# EAGLE design CH348L (EAGLE 9.6.2)
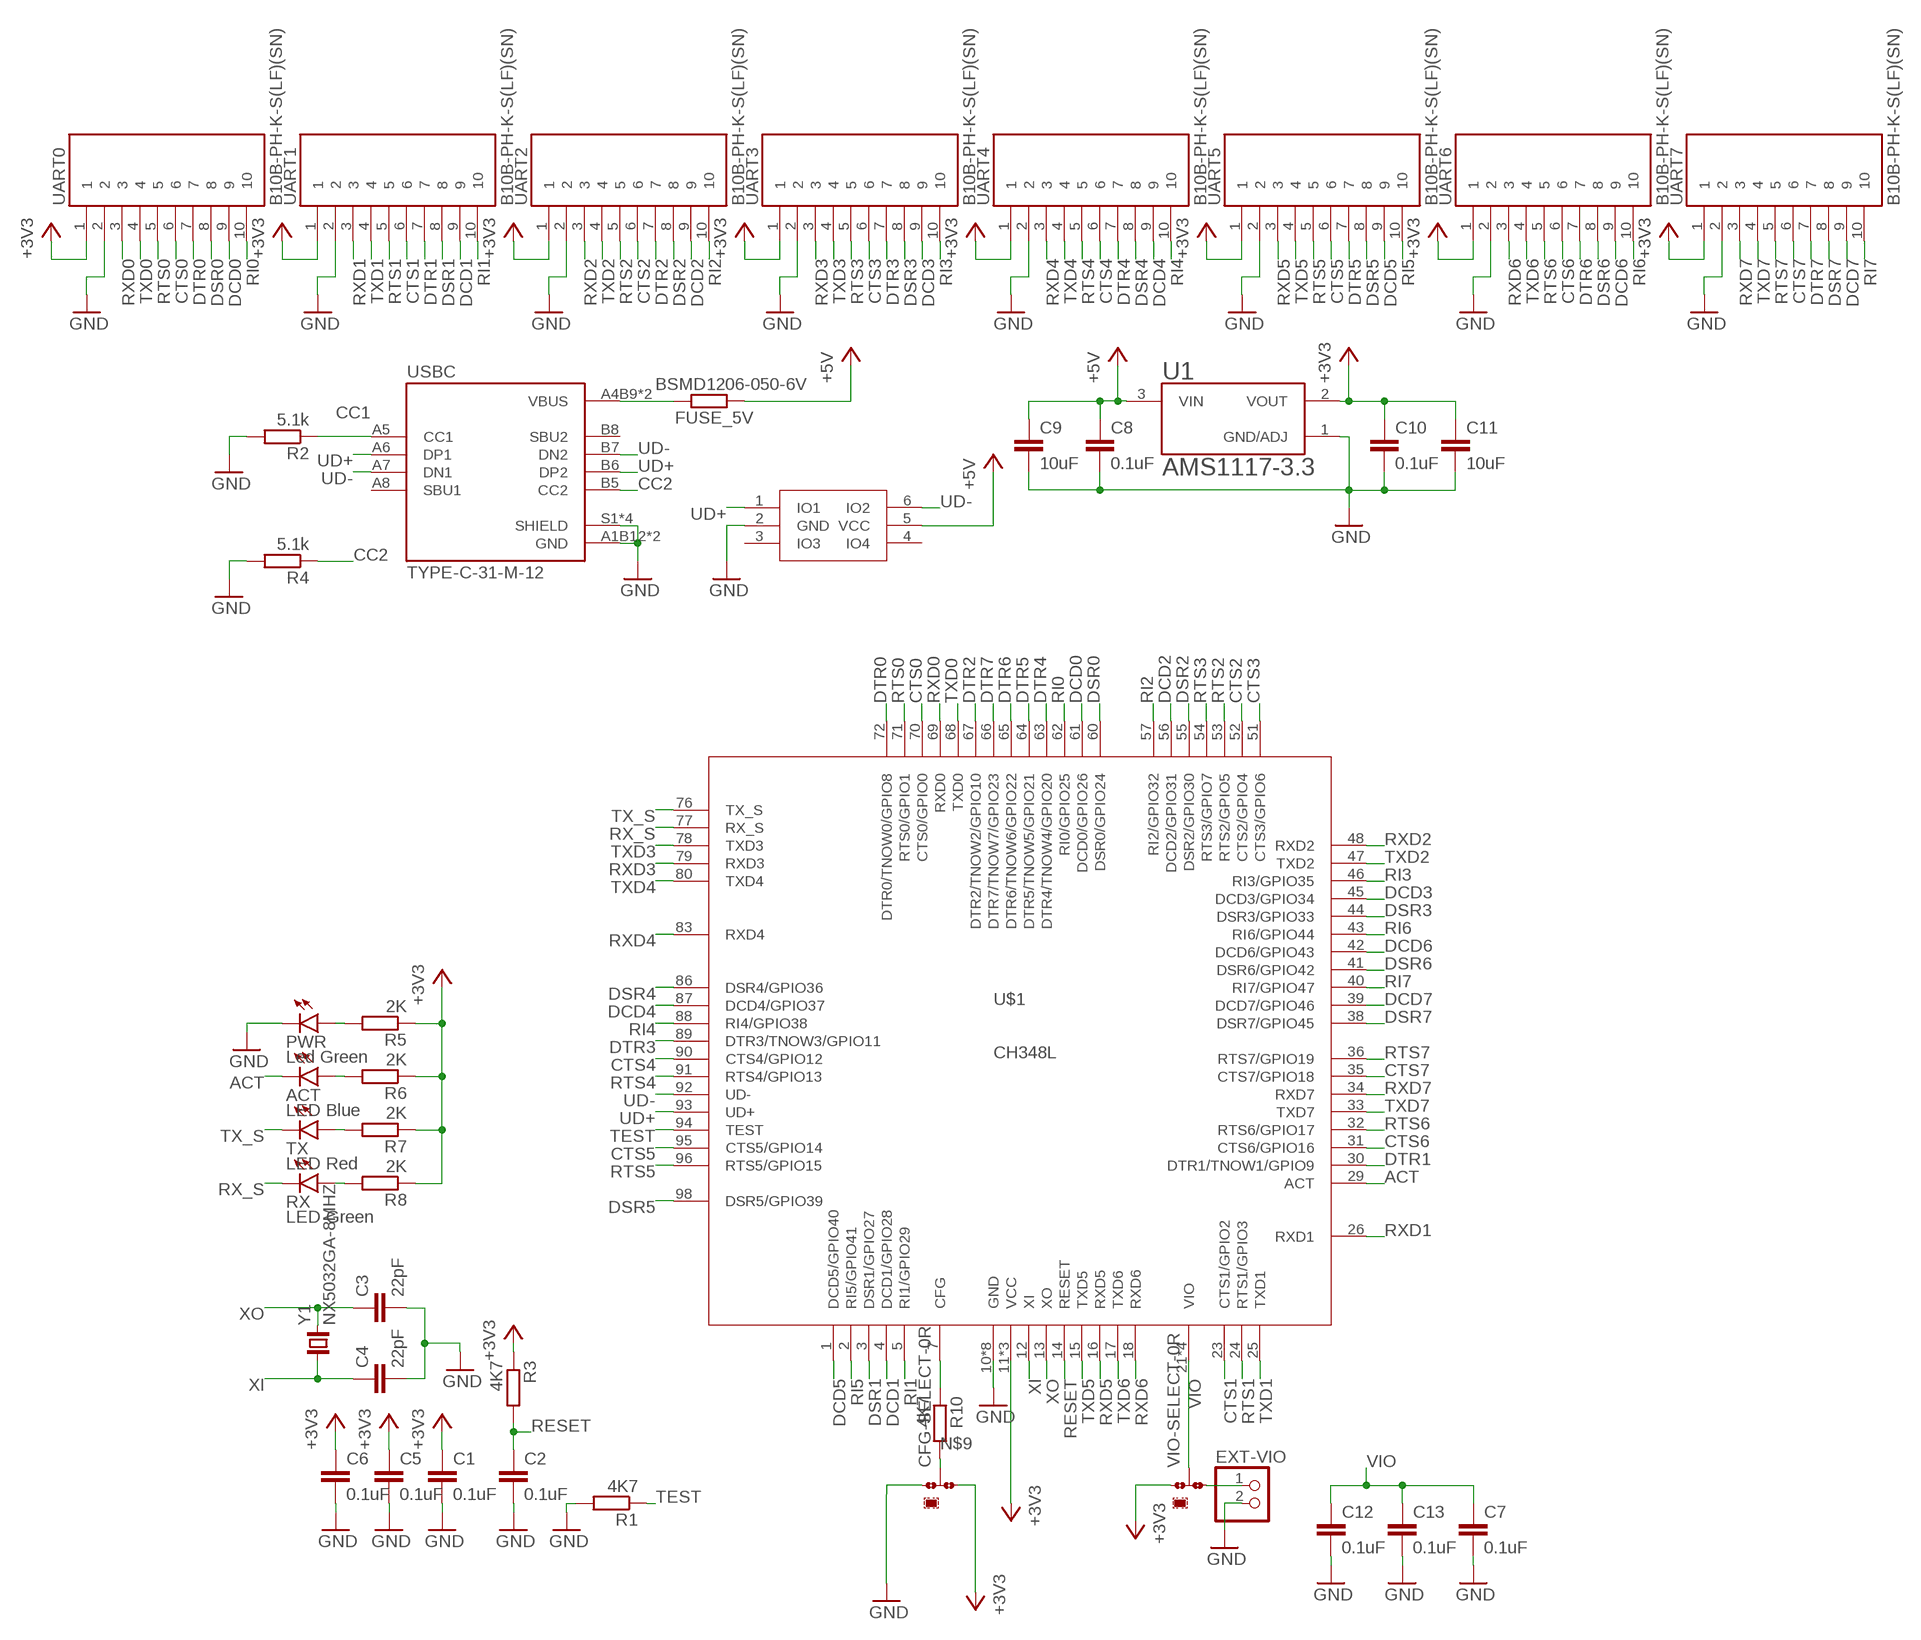
[diagram p0: schematic, sheet 1]

## Parts
ACT  LED Blue  LEDCHIP-LED0603  [CHIP-LED0603]
C1  0.1uF  C-EUC0603  [C0603]
C2  0.1uF  C-EUC0603  [C0603]
C3  22pF  C-EUC0603  [C0603]
C4  22pF  C-EUC0603  [C0603]
C5  0.1uF  C-EUC0603  [C0603]
C6  0.1uF  C-EUC0603  [C0603]
C7  0.1uF  C-EUC0603  [C0603]
C8  0.1uF  C-EUC0603  [C0603]
C9  10uF  C-EUC0805  [C0805]
C10  0.1uF  C-EUC0603  [C0603]
C11  10uF  C-EUC0805  [C0805]
C12  0.1uF  C-EUC0603  [C0603]
C13  0.1uF  C-EUC0603  [C0603]
CFG-SELECT  0R-JUMPA  [A0R-JMP]
EXT-VIO  PINHD-1X2  [1X02]
FUSE_5V  BSMD1206-050-6V  R-EU_R1206  [R1206]
PWR  Led Green  LEDCHIP-LED0603  [CHIP-LED0603]
R1  4K7  R-EU_R0603  [R0603]
R2  5.1k  R-EU_R0603  [R0603]
R3  4K7  R-EU_R0603  [R0603]
R4  5.1k  R-EU_R0603  [R0603]
R5  2K  R-EU_R0603  [R0603]
R6  2K  R-EU_R0603  [R0603]
R7  2K  R-EU_R0603  [R0603]
R8  2K  R-EU_R0603  [R0603]
R10  4K7  R-EU_R0603  [R0603]
RX  LED Green  LEDCHIP-LED0603  [CHIP-LED0603]
TX  LED Red  LEDCHIP-LED0603  [CHIP-LED0603]
U1  AMS1117-3.3  [SOT229P700X180-4N]
U5  ESDU5V0H4  [SOT-23-6]
U$1  CH348L  [LQFP100_14X14]
UART0  B10B-PH-K-S(LF)(SN)  S10B-PH-K-S(LF)(SN)  [JST_S10B-PH-K-S(LF)(SN)]
UART1  B10B-PH-K-S(LF)(SN)  S10B-PH-K-S(LF)(SN)  [JST_S10B-PH-K-S(LF)(SN)]
UART2  B10B-PH-K-S(LF)(SN)  S10B-PH-K-S(LF)(SN)  [JST_S10B-PH-K-S(LF)(SN)]
UART3  B10B-PH-K-S(LF)(SN)  S10B-PH-K-S(LF)(SN)  [JST_S10B-PH-K-S(LF)(SN)]
UART4  B10B-PH-K-S(LF)(SN)  S10B-PH-K-S(LF)(SN)  [JST_S10B-PH-K-S(LF)(SN)]
UART5  B10B-PH-K-S(LF)(SN)  S10B-PH-K-S(LF)(SN)  [JST_S10B-PH-K-S(LF)(SN)]
UART6  B10B-PH-K-S(LF)(SN)  S10B-PH-K-S(LF)(SN)  [JST_S10B-PH-K-S(LF)(SN)]
UART7  B10B-PH-K-S(LF)(SN)  S10B-PH-K-S(LF)(SN)  [JST_S10B-PH-K-S(LF)(SN)]
USBC  TYPE-C-31-M-12  [HRO_TYPE-C-31-M-12]
VIO-SELECT  0R-JUMPA  [A0R-JMP]
Y1  NX5032GA-8MHZ  NX5032GA  [2-SMD-5X3]

## Nets
+3V3: C1.1 C5.1 C6.1 C10.1 C11.1 CFG-SELECT.3 R3.1 R5.1 R6.1 R7.1 R8.1 U1.2(VOUT) U$1.11(VCC) U$1.28(VCC) U$1.75(VCC) UART0.1 UART1.1 UART2.1 UART3.1 UART4.1 UART5.1 UART6.1 UART7.1 VIO-SELECT.1
+5V: C8.1 C9.1 FUSE_5V.1 U1.3(VIN) U5.5(VCC)
ACT: ACT.C U$1.29(ACT)
CC1: R2.1 USBC.A5(CC1)
CC2: R4.1 USBC.B5(CC2)
CFG: R10.1 U$1.7(CFG)
CTS0: U$1.70(CTS0/GPIO0) UART0.6
CTS1: U$1.23(CTS1/GPIO2) UART1.6
CTS2: U$1.52(CTS2/GPIO4) UART2.6
CTS3: U$1.51(CTS3/GPIO6) UART3.6
CTS4: U$1.90(CTS4/GPIO12) UART4.6
CTS5: U$1.95(CTS5/GPIO14) UART5.6
CTS6: U$1.31(CTS6/GPIO16) UART6.6
CTS7: U$1.35(CTS7/GPIO18) UART7.6
DCD0: U$1.61(DCD0/GPIO26) UART0.9
DCD1: U$1.4(DCD1/GPIO28) UART1.9
DCD2: U$1.56(DCD2/GPIO31) UART2.9
DCD3: U$1.45(DCD3/GPIO34) UART3.9
DCD4: U$1.87(DCD4/GPIO37) UART4.9
DCD5: U$1.1(DCD5/GPIO40) UART5.9
DCD6: U$1.42(DCD6/GPIO43) UART6.9
DCD7: U$1.39(DCD7/GPIO46) UART7.9
DSR0: U$1.60(DSR0/GPIO24) UART0.8
DSR1: U$1.3(DSR1/GPIO27) UART1.8
DSR2: U$1.55(DSR2/GPIO30) UART2.8
DSR3: U$1.44(DSR3/GPIO33) UART3.8
DSR4: U$1.86(DSR4/GPIO36) UART4.8
DSR5: U$1.98(DSR5/GPIO39) UART5.8
DSR6: U$1.41(DSR6/GPIO42) UART6.8
DSR7: U$1.38(DSR7/GPIO45) UART7.8
DTR0: U$1.72(DTR0/TNOW0/GPIO8) UART0.7
DTR1: U$1.30(DTR1/TNOW1/GPIO9) UART1.7
DTR2: U$1.67(DTR2/TNOW2/GPIO10) UART2.7
DTR3: U$1.89(DTR3/TNOW3/GPIO11) UART3.7
DTR4: U$1.63(DTR4/TNOW4/GPIO20) UART4.7
DTR5: U$1.64(DTR5/TNOW5/GPIO21) UART5.7
DTR6: U$1.65(DTR6/TNOW6/GPIO22) UART6.7
DTR7: U$1.66(DTR7/TNOW7/GPIO23) UART7.7
GND: C1.2 C2.2 C3.2 C4.2 C5.2 C6.2 C7.2 C8.2 C9.2 C10.2 C11.2 C12.2 C13.2 CFG-SELECT.1 EXT-VIO.2 PWR.C R1.2 R2.2 R4.2 U1.1(GND/ADJ) U5.2(GND) U$1.10(GND) U$1.19(GND) U$1.20(GND) U$1.27(GND) U$1.37(GND) U$1.49(GND) U$1.74(GND) U$1.99(GND) UART0.2 UART1.2 UART2.2 UART3.2 UART4.2 UART5.2 UART6.2 UART7.2 USBC.A1B12(GND) USBC.B1A12(GND) USBC.S1(SHIELD) USBC.S2(SHIELD) USBC.S3(SHIELD) USBC.S4(SHIELD)
N$1: PWR.A R5.2
N$2: FUSE_5V.2 USBC.A4B9(VBUS) USBC.B4A9(VBUS)
N$3: ACT.A R6.2
N$4: R7.2 TX.A
N$5: R8.2 RX.A
N$8: EXT-VIO.1 VIO-SELECT.3
N$9: CFG-SELECT.2 R10.2
RESET: C2.1 R3.2 U$1.14(RESET)
RI0: U$1.62(RI0/GPIO25) UART0.10
RI1: U$1.5(RI1/GPIO29) UART1.10
RI2: U$1.57(RI2/GPIO32) UART2.10
RI3: U$1.46(RI3/GPIO35) UART3.10
RI4: U$1.88(RI4/GPIO38) UART4.10
RI5: U$1.2(RI5/GPIO41) UART5.10
RI6: U$1.43(RI6/GPIO44) UART6.10
RI7: U$1.40(RI7/GPIO47) UART7.10
RTS0: U$1.71(RTS0/GPIO1) UART0.5
RTS1: U$1.24(RTS1/GPIO3) UART1.5
RTS2: U$1.53(RTS2/GPIO5) UART2.5
RTS3: U$1.54(RTS3/GPIO7) UART3.5
RTS4: U$1.91(RTS4/GPIO13) UART4.5
RTS5: U$1.96(RTS5/GPIO15) UART5.5
RTS6: U$1.32(RTS6/GPIO17) UART6.5
RTS7: U$1.36(RTS7/GPIO19) UART7.5
RX_S: RX.C U$1.77(RX_S)
RXD0: U$1.69(RXD0) UART0.3
RXD1: U$1.26(RXD1) UART1.3
RXD2: U$1.48(RXD2) UART2.3
RXD3: U$1.79(RXD3) UART3.3
RXD4: U$1.83(RXD4) UART4.3
RXD5: U$1.16(RXD5) UART5.3
RXD6: U$1.18(RXD6) UART6.3
RXD7: U$1.34(RXD7) UART7.3
TEST: R1.1 U$1.94(TEST)
TX_S: TX.C U$1.76(TX_S)
TXD0: U$1.68(TXD0) UART0.4
TXD1: U$1.25(TXD1) UART1.4
TXD2: U$1.47(TXD2) UART2.4
TXD3: U$1.78(TXD3) UART3.4
TXD4: U$1.80(TXD4) UART4.4
TXD5: U$1.15(TXD5) UART5.4
TXD6: U$1.17(TXD6) UART6.4
TXD7: U$1.33(TXD7) UART7.4
UD+: U5.1(IO1) U$1.93(UD+) USBC.A6(DP1) USBC.B6(DP2)
UD-: U5.6(IO2) U$1.92(UD-) USBC.A7(DN1) USBC.B7(DN2)
VIO: C7.1 C12.1 C13.1 U$1.21(VIO) U$1.22(VIO) U$1.50(VIO) U$1.100(VIO) VIO-SELECT.2
XI: C4.1 U$1.12(XI) Y1.1
XO: C3.1 U$1.13(XO) Y1.2
Unconnected: U5.3(IO3) U5.4(IO4) USBC.A8(SBU1) USBC.B8(SBU2)

## Library data of the parts
ACT PWR RX TX = led:LED: LED OSRAM: - CHIPLED LG R971, LG N971, LY N971, LG Q971, LY Q971, LO R971, LY R971 LH N974, LH R974 LS Q976, LO Q976, LY Q976 LO Q996 - Hyper CHIPLED LW Q18S LB Q993, LB Q99A, LB R99A - SideLED LS A670, LO A670, LY A670, LG A670, LP A670 LB A673, LV A673, LT A673, LW A673 LH A674 LY A675 LS A676, LA A676, LO A676, LY A676, LW A676 LS A679, LY A679, LG A679 - Hyper Micro SIDELED® LS Y876, LA Y876, LO Y876, LY Y876 LT Y87S - SmartLED LW L88C, LW L88S LB L89C, LB L89S, LG L890 LS L89K, LO L89K, LY L89K LS L896, LA L896, LO L896, LY L896 - TOPLED LS T670, LO T670, LY T670, LG T670, LP T670 LSG T670, LSP T670, LSY T670, LOP T670, LYG T670 LG T671, LOG T671, LSG T671 LB T673, LV T673, LT T673, LW T673 LH T674 LS T676, LA T676, LO T676, LY T676, LB T676, LH T676, LSB T676, LW T676 LB T67C, LV T67C, LT T67C, LS T67K, LO T67K, LY T67K, LW E67C LS E67B, LA E67B, LO E67B, LY E67B, LB E67C, LV E67C, LT E67C LW T67C LS T679, LY T679, LG T679 LS T770, LO T770, LY T770, LG T770, LP T770 LB T773, LV T773, LT T773, LW T773 LH T774 LS E675, LA E675, LY E675, LS T675 LS T776, LA T776, LO T776, LY T776, LB T776 LHGB T686 LT T68C, LB T68C - Hyper Mini TOPLED® LB M676 - Mini TOPLED Santana® LG M470 LS M47K, LO M47K, LY M47K Source: http://www.osram.convergy.de LUXEON: - LUMILED® LXK2-PW12-R00, LXK2-PW12-S00, LXK2-PW14-U00, LXK2-PW14-V00 LXK2-PM12-R00, LXK2-PM12-S00, LXK2-PM14-U00 LXK2-PE12-Q00, LXK2-PE12-R00, LXK2-PE12-S00, LXK2-PE14-T00, LXK2-PE14-U00 LXK2-PB12-K00, LXK2-PB12-L00, LXK2-PB12-M00, LXK2-PB14-N00, LXK2-PB14-P00, LXK2-PB14-Q00 LXK2-PR12-L00, LXK2-PR12-M00, LXK2-PR14-Q00, LXK2-PR14-R00 LXK2-PD12-Q00, LXK2-PD12-R00, LXK2-PD12-S00 LXK2-PH12-R00, LXK2-PH12-S00 LXK2-PL12-P00, LXK2-PL12-Q00, LXK2-PL12-R00 Source: www.luxeon.com KINGBRIGHT: KA-3528ASYC Source: www.kingbright.com
C1-C13 = rcl:C-EU: CAPACITOR, European symbol; SPICEPREFIX: C
CFG-SELECT VIO-SELECT = jump-0r-smd:0R-JUMP: SMD 0R 0805 Jumper
EXT-VIO = pinhead:PINHD-1X2: PIN HEADER
FUSE_5V R1-R8 R10 = rcl:R-EU_: RESISTOR, European symbol; SPICEPREFIX: R
U1 = AMS1117-3.3:AMS1117-3.3: Check availability <https://pricing.snapeda.com/parts/AMS1117-3.3/Advanced%20Monolithic%20Systems/view-part?ref=eda>; AVAILABILITY: Not in stock; DESCRIPTION: Sot223/Pkg 1-Amp 3.3-Volt Low Drop Out Voltage Regulatator; MF: Advanced Monolithic Systems; MP: AMS1117-3.3; PACKAGE: SOT-223 Seeed Technology; PRICE: None
U5 = ESDU5V0H4:ESDU5V0H4
U$1 = CH348L:CH348L
UART0 UART1-UART7 = S10B-PH-K-S_LF__SN_:S10B-PH-K-S(LF)(SN): PH Series 6 Position 2 mm Pitch Through Hole Side Entry Shrouded Header Check availability <https://pricing.snapeda.com/parts/S6B-PH-K-S%28LF%29%28SN%29/JST%20Sales/view-part?ref=eda>; AVAILABILITY: In Stock; DESCRIPTION: Connector Header Through Hole, Right Angle 6 position 0.079 (2.00mm); MF: JST Sales; MP: S6B-PH-K-S(LF)(SN); PACKAGE: None; PRICE: None; PURCHASE-URL: https://pricing.snapeda.com/search/part/S6B-PH-K-S(LF)(SN)/?ref=eda
USBC = TYPE-C-31-M-12:TYPE-C-31-M-12: USB Connectors 24 Receptacle 1 8.94*7.3mm RoHS; AVAILABILITY: Unavailable; DESCRIPTION: USB Connectors 24 Receptacle 1 8.94*7.3mm RoHS; MF: HRO Electronics Co., Ltd.; MP: TYPE-C-31-M-12; PACKAGE: Package; PRICE: None
Y1 = NX5032GA:NX5032GA: CRYSTAL Check availability <https://pricing.snapeda.com/parts/NX5032GA/NDK%20America%2C/view-part?ref=eda>; AVAILABILITY: Not in stock; DESCRIPTION: 10 MHz ±50ppm Crystal 8pF 120 Ohms 2-SMD, No Lead; MF: NDK America,; MP: NX5032GA; PACKAGE: SMD-2 NDK America, Inc.; PRICE: None

## Board
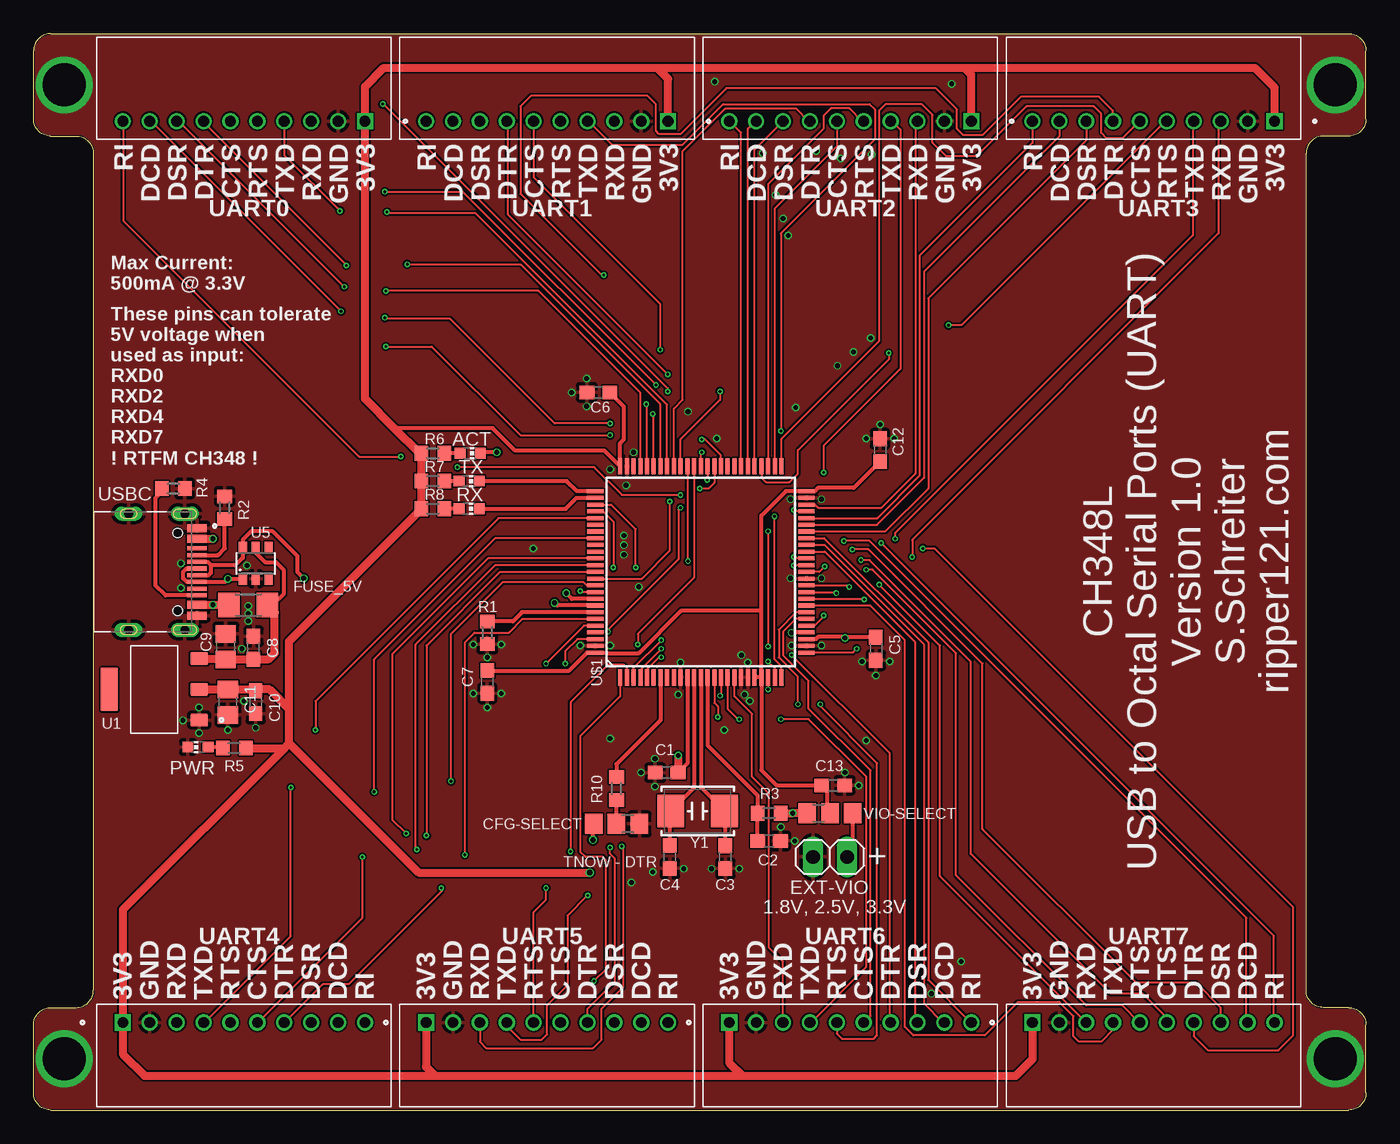
[diagram p1: board, top side]
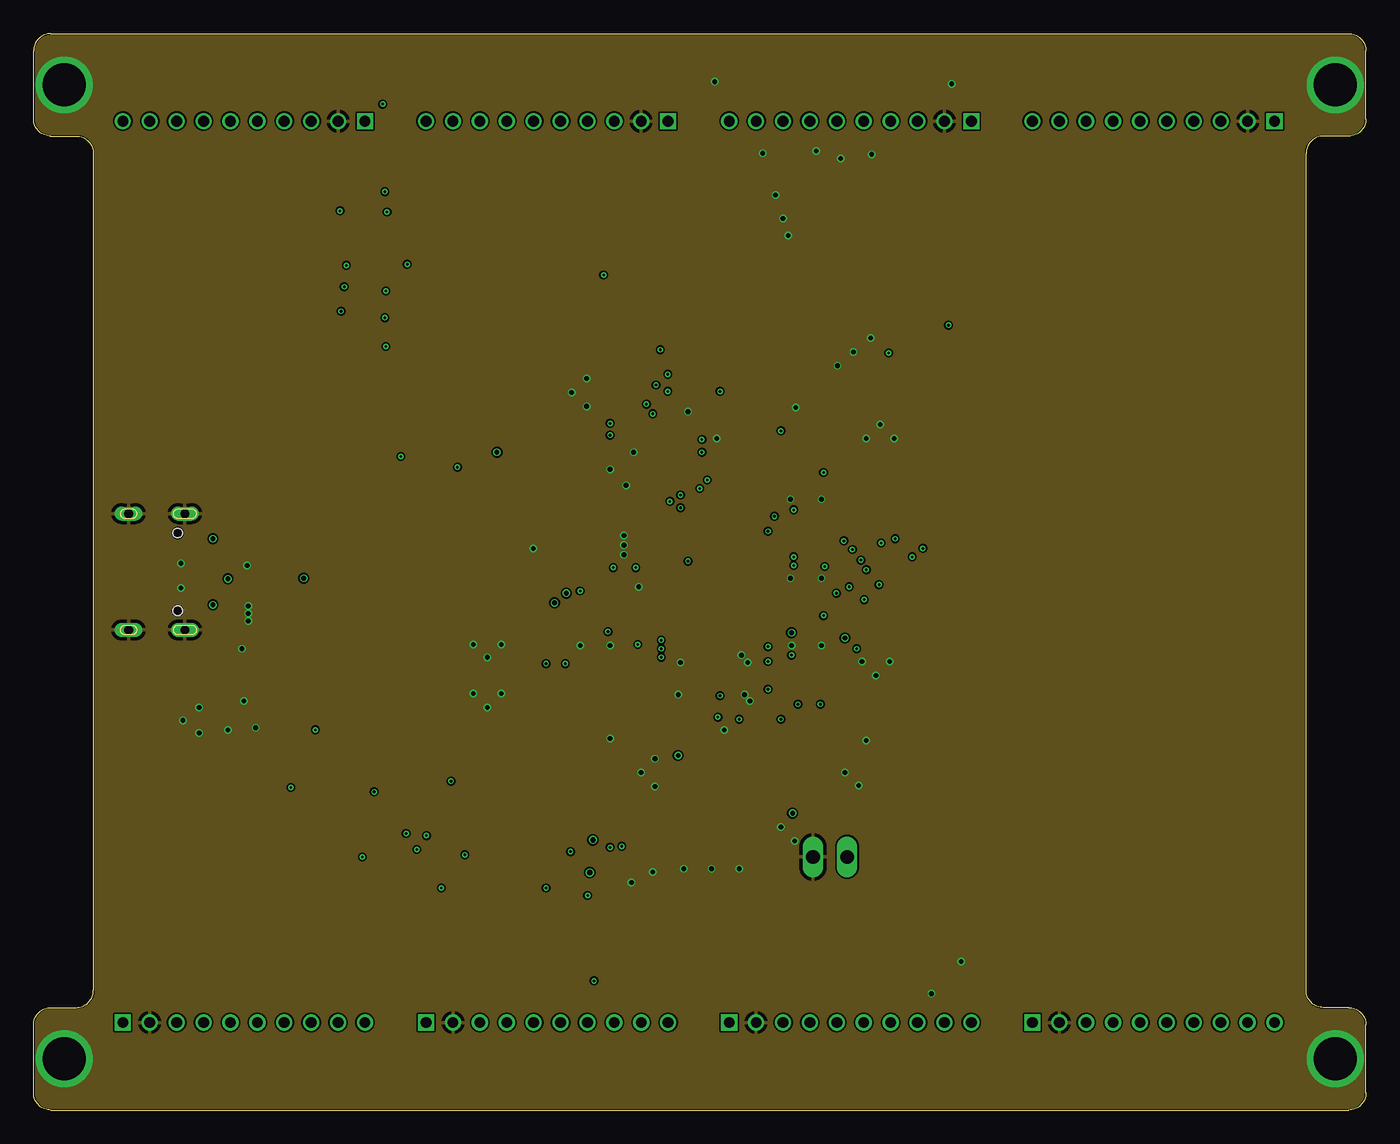
[diagram p2: board, inner layer Route2]
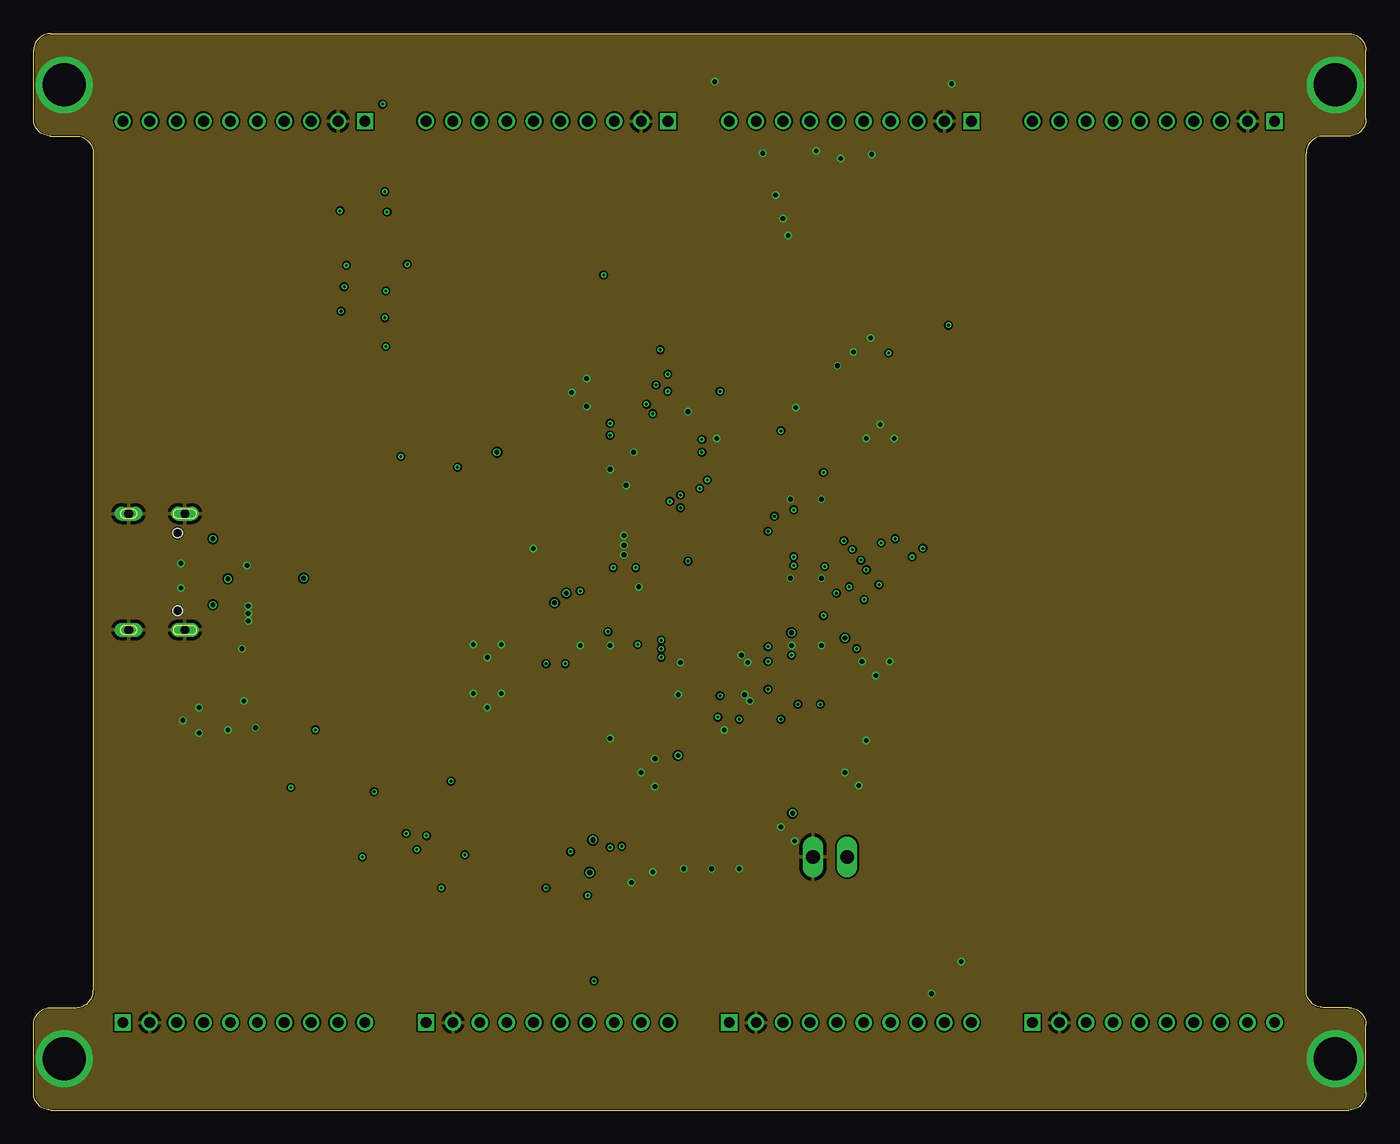
[diagram p3: board, inner layer Route15]
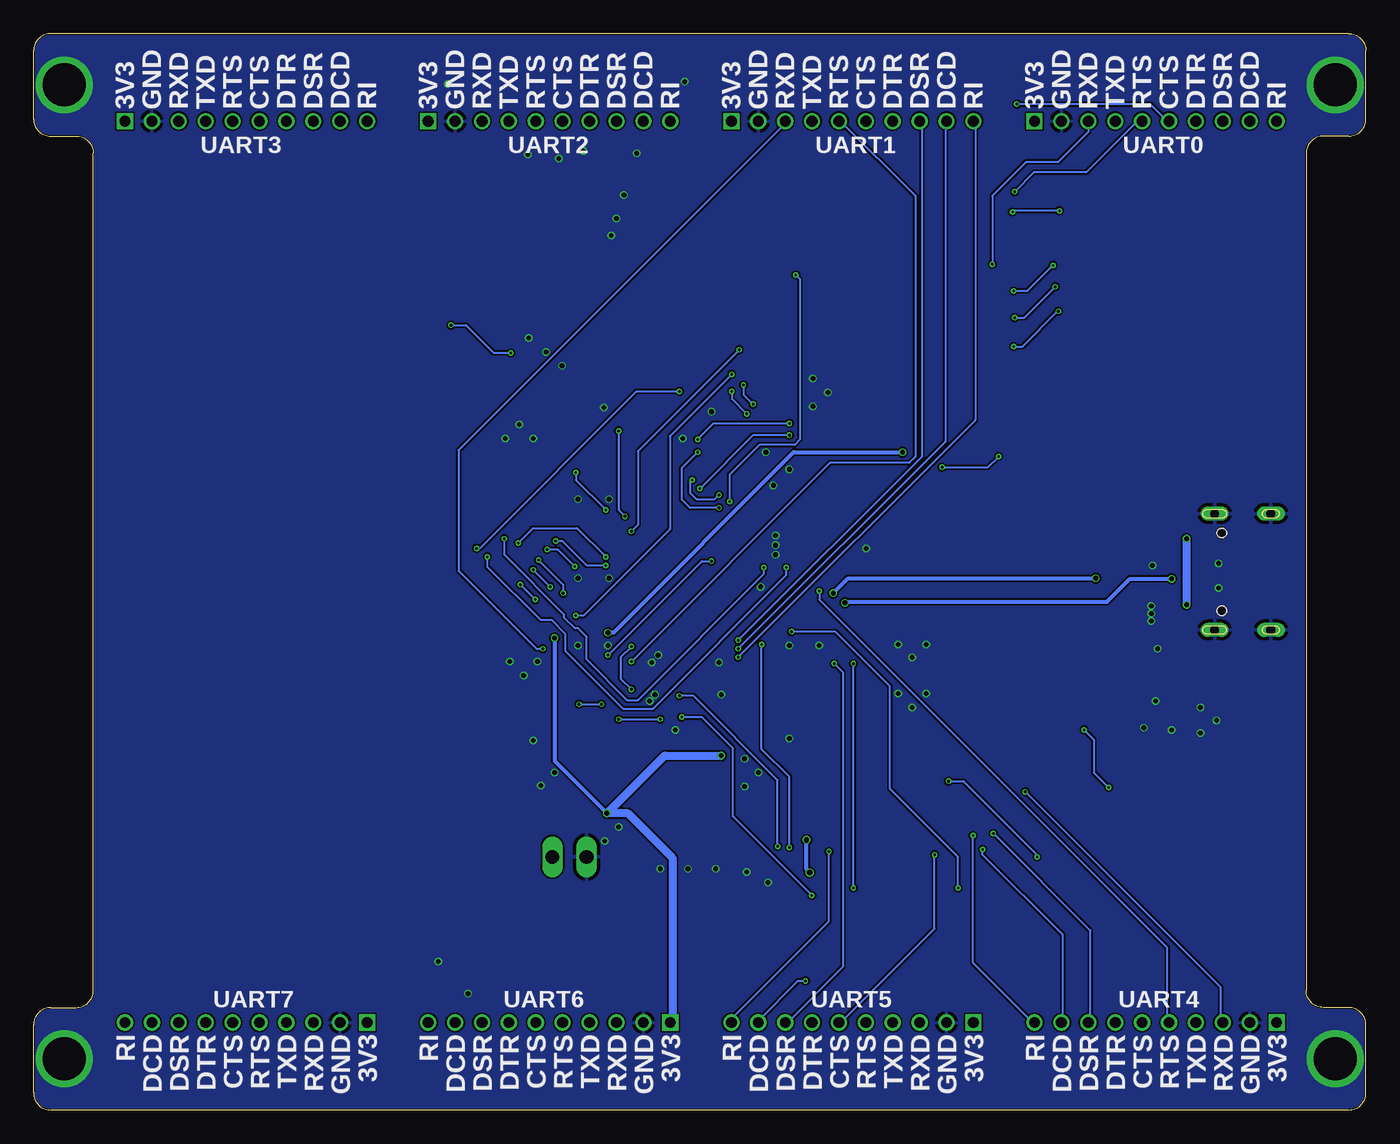
[diagram p4: board, bottom side, seen from below]

Size 99.06 x 80.01 mm. Coordinates in mm from the lower left corner, seen from the top.
Outline: 1.27,0 97.79,0 arc90 99.06,1.27 99.06,6.35 arc90 97.79,7.62 95.89,7.62 arc-90 94.61,8.89 94.61,71.12 arc-90 95.89,72.39 97.79,72.39 arc90 99.06,73.66 99.06,78.74 arc90 97.79,80.01 1.27,80.01 arc90 0,78.74 0,73.66 arc90 1.27,72.39 3.17,72.39 arc-90 4.44,71.12 4.44,8.89 arc-90 3.17,7.62 1.27,7.62 arc90 0,6.35 0,1.27 arc90 1.27,0
Copper layers (1*16): Top 0.035mm / dielectric 1.6mm / Bottom 0.035mm
Design rules "jlcpcb-2-layer *": minimum track width 3.5mil, minimum drill 0.2mm, track to track 5mil, track to pad 5mil, pad to pad 5mil, via to via 5mil, smd to smd 0mil, copper to edge 0.1mm, drill to drill 5mil, minimum pad ring 4mil, minimum via ring 4mil, stop-mask expansion 3mil, vias tented up to drill 100mil, thermal gap 10mil

### Footprints (pad centres in the part's own frame; a part is rotated, then mirrored left to right if it is on the bottom)
CHIP-LED0603 = smd 0.8 x 0.8: A 0,-0.75; C 0,0.75
C0603 = smd 1.1 x 1: 1 -0.85,0; 2 0.85,0
C0805 = smd 1.3 x 1.5: 1 -0.95,0; 2 0.95,0
A0R-JMP = smd 1.5 x 1.3: 1 0,1.7; 2 0,0; 3 0,-1.7
1X02 = drill 1.016 long: 1 -1.27,0; 2 1.27,0
R1206 = smd 1.6 x 1.803: 1 -1.422,0; 2 1.422,0
R0603 = smd 1 x 1.1: 1 -0.85,0; 2 0.85,0
SOT229P700X180-4N = smd 1.31 x 0.93: 1 -3.345,2.29; 2 -3.345,0; 3 -3.345,-2.29 | smd 1.31 x 3.24: 4 3.345,0
SOT-23-6 = smd 0.6 x 0.9: 1 -0.95,-1.15; 2 0,-1.15; 3 0.95,-1.15; 4 0.95,1.15; 5 0,1.15; 6 -0.95,1.15
LQFP100_14X14 = smd 1.2 x 0.3: 1 -7.85,6; 2 -7.85,5.5; 3 -7.85,5; 4 -7.85,4.5; 5 -7.85,4; 6 -7.85,3.5; 7 -7.85,3; 8 -7.85,2.5; 9 -7.85,2; 10 -7.85,1.5; 11 -7.85,1; 12 -7.85,0.5; 13 -7.85,0; 14 -7.85,-0.5; 15 -7.85,-1; 16 -7.85,-1.5; 17 -7.85,-2; 18 -7.85,-2.5; 19 -7.85,-3; 20 -7.85,-3.5; 21 -7.85,-4; 22 -7.85,-4.5; 23 -7.85,-5; 24 -7.85,-5.5; 25 -7.85,-6; 51 7.85,-6; 52 7.85,-5.5; 53 7.85,-5; 54 7.85,-4.5; 55 7.85,-4; 56 7.85,-3.5; 57 7.85,-3; 58 7.85,-2.5; 59 7.85,-2; 60 7.85,-1.5; 61 7.85,-1; 62 7.85,-0.5; 63 7.85,0; 64 7.85,0.5; 65 7.85,1; 66 7.85,1.5; 67 7.85,2; 68 7.85,2.5; 69 7.85,3; 70 7.85,3.5; 71 7.85,4; 72 7.85,4.5; 73 7.85,5; 74 7.85,5.5; 75 7.85,6 | smd 0.3 x 1.2: 26 -6,-7.85; 27 -5.5,-7.85; 28 -5,-7.85; 29 -4.5,-7.85; 30 -4,-7.85; 31 -3.5,-7.85; 32 -3,-7.85; 33 -2.5,-7.85; 34 -2,-7.85; 35 -1.5,-7.85; 36 -1,-7.85; 37 -0.5,-7.85; 38 0,-7.85; 39 0.5,-7.85; 40 1,-7.85; 41 1.5,-7.85; 42 2,-7.85; 43 2.5,-7.85; 44 3,-7.85; 45 3.5,-7.85; 46 4,-7.85; 47 4.5,-7.85; 48 5,-7.85; 49 5.5,-7.85; 50 6,-7.85; 76 6,7.85; 77 5.5,7.85; 78 5,7.85; 79 4.5,7.85; 80 4,7.85; 81 3.5,7.85; 82 3,7.85; 83 2.5,7.85; 84 2,7.85; 85 1.5,7.85; 86 1,7.85; 87 0.5,7.85; 88 0,7.85; 89 -0.5,7.85; 90 -1,7.85; 91 -1.5,7.85; 92 -2,7.85; 93 -2.5,7.85; 94 -3,7.85; 95 -3.5,7.85; 96 -4,7.85; 97 -4.5,7.85; 98 -5,7.85; 99 -5.5,7.85; 100 -6,7.85
JST_S10B-PH-K-S(LF)(SN) = drill 0.8 pad 1.2 square: 1 -9,0 | drill 0.8 pad 1.2: 2 -7,0; 3 -5,0; 4 -3,0; 5 -1,0; 6 1,0; 7 3,0; 8 5,0; 9 7,0; 10 9,0
HRO_TYPE-C-31-M-12 = smd 0.6 x 1.45: A1B12 -3.25,5.095; A4B9 -2.45,5.095; B1A12 3.25,5.095; B4A9 2.45,5.095 | smd 0.3 x 1.45: A5 -1.25,5.095; A6 -0.25,5.095; A7 0.25,5.095; A8 1.25,5.095; B5 1.75,5.095; B6 0.75,5.095; B7 -0.75,5.095; B8 -1.75,5.095 | drill 0.65 pad 1.05 long: S1 -4.32,4.18; S2 4.32,4.18; S3 -4.32,0; S4 4.32,0 | hole 0.7: -2.89,3.65; 2.89,3.65
2-SMD-5X3 = smd 2 x 2.4: 1 -2,0; 2 2,0

### Placement (x,y rotation side)
ACT  32.46,48.82 270 top
C1  47.07,25.08 180 top
C2  54.69,20 0 top
C3  51.44,18.81 270 top
C4  47.31,18.81 270 top
C5  62.63,34.29 270 top
C6  41.99,53.34 180 top
C7  33.73,31.83 270 top
C8  16.35,34.37 90 top
C9  14.29,34.45 90 top
C10  16.51,30.32 270 top
C11  14.45,30.32 270 top
C12  62.94,49.05 90 top
C13  59.45,24.13 0 top
CFG-SELECT  43.34,21.27 270 top
EXT-VIO  59.21,18.81 180 top
FUSE_5V  15.95,37.54 180 top
PWR  12.22,26.98 90 top
R1  33.73,35.48 270 top
R2  14.21,44.77 90 top
R3  54.69,22.07 180 top
R4  10.4,46.2 0 top
R5  14.92,26.91 180 top
R6  29.69,48.82 0 top
R7  29.69,46.75 0 top
R8  29.69,44.69 0 top
R10  43.34,23.89 270 top
RX  32.38,44.69 270 top
TX  32.38,46.75 270 top
U1  8.97,31.27 180 top
U5  16.51,40.64 0 top
U$1  49.61,40.01 90 top
UART0  15.64,73.5 180 top
UART1  38.18,73.5 180 top
UART2  60.72,73.5 180 top
UART3  83.26,73.5 180 top
UART4  15.64,6.51 0 top
UART5  38.18,6.51 0 top
UART6  60.72,6.51 0 top
UART7  83.26,6.51 0 top
USBC  7.06,40.01 270 top
VIO-SELECT  59.21,22.07 90 top
Y1  49.37,22.23 0 top

### Tracks (layer width: path | path; a pad name or v marks a point on that pad's centre or on a via)
+3V3  (via drill 0.35, 0.4)
  Top 0.305: U$1.11 48.61,25.77 C1.1 | U$1.28 58.17,35.01 58.33,35.16 60.24,35.16 v60.32,35.08 60.38,35.14 C5.1 | 26.8,50.7 34.13,50.7 35.81,49.02 42.45,49.02 U$1.75 43.61,49.56 43.89,49.85 43.89,52.28 C6.1 | CFG-SELECT.3 41.67,21.24 41.59,21.24 v41.59,20.08
  Top 0.61: U1.2 C11.1 16.41,31.27 | 16.41,31.27 C10.1 | UART7.1 74.3,6.48 74.3,3.81 73.03,2.54 52.7,2.54 | 29.84,2.54 8.26,2.54 6.64,4.16 UART4.1 6.64,14.89 18.65,26.91 | 29.84,2.54 52.7,2.54 | UART5.1 29.18,3.21 29.84,2.54 | UART6.1 51.72,3.52 52.7,2.54 | 18.97,29.84 18.97,34.82 R8.1 R7.1 R6.1 28.68,48.82 26.8,50.7 24.64,52.86 UART0.1 24.64,76.07 26.04,77.47 46.35,77.47 | 46.35,77.47 69.22,77.47 | 69.22,77.47 90.8,77.47 92.26,76.01 UART3.1 | UART2.1 69.72,76.96 69.22,77.47 | UART1.1 47.18,76.65 46.35,77.47 | R3.1 v56.44,22.07 VIO-SELECT.1 | v47.92,26.35 C1.1 | v41.35,17.64 28.63,17.64 18.97,27.3 | 16.41,31.27 17.54,31.27 18.97,29.84 | 18.97,29.84 18.97,27.3 | 18.97,27.3 18.97,27.23 18.65,26.91 | R5.1 18.65,26.91
  Bottom 0.305: v60.32,35.08 60.32,25.96 v56.44,22.07 | v41.35,17.64 41.59,17.88 v41.59,20.08
  Bottom 0.61: v47.92,26.35 52.15,26.35 v56.44,22.07 v56.43,22.06 54.87,22.06 51.56,18.75 51.56,6.67 UART6.1
+5V
  Top 0.305: U5.5 16.51,41.43 17.22,40.72 18.02,40.72 18.57,40.16 18.57,38.34 17.78,37.54 FUSE_5V.1
  Top 0.61: U1.3 14.22,33.56 C9.1 16.33,33.5 C8.1 17.49,33.52 17.94,33.97 17.94,36.98 FUSE_5V.1
ACT  (via drill 0.35)
  Top 0.305: ACT.C 33.29,48.9 v34.45,48.9 | U$1.29 56.38,35.51 v56.36,35.48
  Bottom 0.305: v34.45,48.9 42.55,48.9 55.96,35.48 v56.36,35.48
CC1
  Top 0.305: USBC.A5 13.71,41.26 14.21,41.75 R2.1
CC2
  Top 0.305: USBC.B5 9.8,38.26 9.05,39.01 9.05,45.48 9.55,45.98 R4.1
CFG
  Top 0.305: U$1.7 46.61,28.99 43.34,25.72 R10.1
CTS0  (via drill 0.2)
  Top 0.152: v47.15,53.42 47.15,53.66 26.04,74.77 v25.96,74.77 | U$1.70 46.11,51.68 v46.04,51.75
  Bottom 0.152: v47.15,53.42 47.15,52.86 v46.04,51.75 | v25.96,74.77 16.03,74.77 14.76,73.5 UART0.6
CTS1  (via drill 0.2)
  Top 0.152: v54.61,43.02 v54.61,34.45 | v46.59,56.52 46.59,59.93 37.18,69.34 UART1.6 | U$1.23 v54.61,31.27
  Bottom 0.152: v54.61,31.27 55.4,32.07 55.4,33.66 v54.61,34.45 | v54.61,43.02 54.13,43.5 54.13,48.97 v46.59,56.52
CTS2
  Top 0.152: UART2.6 59.72,71.63 55.11,67.02 U$1.52
CTS3
  Top 0.152: UART3.6 82.23,73.5 80.96,72.23 79.77,72.23 79.38,72.63 79.38,74.06 78.82,74.61 73.82,74.61 70.09,70.88 67.87,70.88 66.83,71.91 66.83,73.98 66.04,74.77 63.34,74.77 62.86,74.3 62.86,57.15 55.61,49.89 U$1.51
CTS4  (via drill 0.2)
  Top 0.152: v31.04,24.45 31.04,35.4 34.88,39.24 40.89,39.24 41.12,39.01 U$1.90 | v24.45,18.81 24.45,14.29 16.67,6.51 UART4.6
  Bottom 0.152: v24.45,18.81 24.45,18.97 29.92,24.45 v31.04,24.45
CTS5  (via drill 0.2)
  Top 0.152: v32.07,18.97 32.07,34.77 32.78,35.48 35.34,35.48 36.36,36.51 U$1.95
  Bottom 0.152: v32.07,18.97 32.07,13.49 39.05,6.51 UART5.6
CTS6
  Top 0.152: UART6.6 61.75,6.51 62.23,6.99 62.23,25.24 57.63,29.84 57.63,31.91 55.72,33.81 55.72,35.56 56.67,36.51 U$1.31
CTS7  (via drill 0.2)
  Top 0.152: v61.52,40.88 62.15,40.88 69.69,33.34 69.69,19.05 80.09,8.65 82.47,8.65 84.26,6.86 UART7.6 | U$1.35 59.6,38.51 v59.69,38.42
  Bottom 0.152: v61.52,40.88 59.69,39.05 v59.69,38.42
DCD0  (via drill 0.2)
  Top 0.152: v49.53,46.2 50.16,46.2 50.61,46.64 U$1.61 | v42.86,50.16 36.2,50.16 29.61,56.75 v26.19,56.75 | v22.86,59.37 8.73,73.5 UART0.9
  Bottom 0.152: v49.53,46.2 45.56,50.16 v42.86,50.16 | v22.86,59.37 22.94,59.37 25.56,56.75 v26.19,56.75
DCD1  (via drill 0.2)
  Top 0.152: U$1.4 45.11,32.73 v46.67,34.29
  Bottom 0.152: v46.67,34.29 31.27,49.69 31.27,73.5 UART1.9
DCD2
  Top 0.152: UART2.9 53.66,73.5 53.11,72.95 U$1.56
DCD3
  Top 0.152: UART3.9 76.26,72.38 66.2,62.31 66.2,46.99 62.71,43.51 U$1.45
DCD4  (via drill 0.2)
  Top 0.152: v28.5,19.37 28.42,19.45 28.42,34.61 34.31,40.51 U$1.87
  Bottom 0.152: v28.5,19.37 28.5,18.97 22.54,13.02 22.54,6.51 UART4.9
DCD5  (via drill 0.2)
  Top 0.152: v41.67,9.6 42.55,10.48 42.55,18.57 42.31,18.81 41.04,18.81 40.64,19.21 40.64,27.78 43.61,30.75 U$1.1
  Bottom 0.152: UART5.9 45.18,6.65 42.23,9.6 v41.67,9.6
DCD6
  Top 0.152: UART6.9 67.63,6.51 66.2,7.94 66.2,34.61 58.8,42.01 U$1.42
DCD7  (via drill 0.2)
  Top 0.152: v60.25,42.31 62.15,42.31 90.17,14.29 90.17,6.51 UART7.9 | U$1.39 56.54,40.51 v56.52,40.48
  Bottom 0.152: v56.52,40.48 57.94,40.48 59.77,42.31 v60.25,42.31
DSR0  (via drill 0.2)
  Top 0.152: v42.86,51.04 38.73,51.04 30.96,58.82 26.19,58.82 v26.11,58.9 | v23.1,61.2 10.79,73.5 UART0.8 | U$1.60 51.11,48.66 49.93,49.85 v49.69,49.85
  Bottom 0.152: v49.69,49.85 48.5,51.04 v42.86,51.04 | v26.11,58.9 25.4,58.9 v23.1,61.2
DSR1  (via drill 0.2)
  Top 0.152: v46.67,34.92 44.61,32.86 U$1.3
  Bottom 0.152: v46.67,34.92 33.02,48.58 33.02,73.34 UART1.8 | UART1.8
DSR2
  Top 0.152: UART2.8 53.61,71.39 U$1.55
DSR3
  Top 0.152: UART3.8 78.26,72.07 66.52,60.33 66.52,46.2 63.33,43.01 U$1.44
DSR4  (via drill 0.2)
  Top 0.152: v27.7,20.56 26.67,21.59 26.67,33.89 33.78,41.01 U$1.86
  Bottom 0.152: v27.7,20.56 20.48,13.34 20.48,6.51 UART4.8
DSR5  (via drill 0.2)
  Top 0.152: U$1.98 40.84,35.01 40.44,35.01 39.53,34.09 v39.53,33.18
  Bottom 0.152: v39.53,33.18 38.89,32.54 38.89,10.64 43.02,6.51 UART5.8
DSR6
  Top 0.152: UART6.8 65.56,6.51 65.56,34.77 58.82,41.51 U$1.41
DSR7  (via drill 0.2)
  Top 0.152: U$1.38 58.42,40.01 v58.82,40.4 | v60.88,41.67 62.07,41.67 70.56,33.18 70.56,20.88 81.99,9.45 86.44,9.45 88.26,7.62 UART7.8
  Bottom 0.152: v60.88,41.67 60.09,41.67 v58.82,40.4
DTR0  (via drill 0.2)
  Top 0.152: v26.19,60.88 37.54,60.88 45.11,53.32 U$1.72 | UART0.7 12.64,73.41 v23.26,62.79
  Bottom 0.152: v26.19,60.88 25.16,60.88 v23.26,62.79
DTR1  (via drill 0.2)
  Top 0.152: v58.74,36.75 58.74,36.67 58.07,36.01 U$1.30 | v47.15,54.69 35.24,66.6 35.24,73.5 UART1.7
  Bottom 0.152: v58.74,36.75 58.18,36.75 51.75,43.18 51.75,50.09 v47.15,54.69
DTR2
  Top 0.152: UART2.7 57.63,73.5 56.67,74.45 51.44,74.45 48.26,71.28 48.26,52.78 47.61,52.13 U$1.67
DTR3  (via drill 0.2)
  Top 0.152: v47.31,45.24 47.31,41.59 45.22,39.51 U$1.89 | v42.39,62.07 42.23,62.07 36.2,68.1 36.2,74.61 36.99,75.41 45.64,75.41 46.28,74.77 46.28,72.79 46.51,72.55 48.1,72.55 51.51,75.96 67.07,75.96 68.66,74.37 68.66,72.95 69.14,72.47 70.56,72.47 73.42,75.33 79.22,75.33 80.26,74.28 UART3.7
  Bottom 0.152: v47.31,45.24 47.31,47.23 45.09,49.45 42.47,49.45 42.07,49.85 42.07,61.75 v42.39,62.07
DTR4  (via drill 0.2)
  Top 0.152: v48.1,44.77 47.94,44.61 47.94,40.96 42.7,35.72 v42.7,35.56 | v30.32,16.51 30.32,16.27 23.42,9.37 21.49,9.37 UART4.7 | U$1.63 49.61,48.82 v49.69,48.9
  Bottom 0.152: v49.69,48.9 50.88,47.7 50.88,45.4 50.24,44.77 v48.1,44.77 | v42.7,35.56 39.45,35.56 35.4,31.51 35.4,23.89 30.32,18.81 v30.32,16.51
DTR5  (via drill 0.2)
  Top 0.152: v42.86,19.53 42.86,19.05 43.18,18.73 43.18,9.53 41.18,7.52 UART5.7 | U$1.64 49.11,39.58 44.93,35.4 v44.93,34.61
  Bottom 0.152: v44.93,34.61 44.93,26.83 42.86,24.77 v42.86,19.53
DTR6  (via drill 0.2)
  Top 0.152: v56.36,33.81 63.66,26.51 63.66,6.51 UART6.7 | v48.66,40.8 48.61,40.85 U$1.65
  Bottom 0.152: v48.66,40.8 49.37,40.8 v56.36,33.81
DTR7  (via drill 0.2)
  Top 0.152: v66.12,41.75 66.99,41.75 93.66,15.08 93.66,5.56 92.55,4.45 87.31,4.45 86.26,5.49 UART7.7 | U$1.66 48.11,49.86 51.04,52.78 v51.04,53.42
  Bottom 0.152: v51.04,53.42 54.21,53.42 65.88,41.75 v66.12,41.75
GND  (via drill 0.35, 3.2)
  other vias: 10.95,40.64 10.95,38.81 15.88,40.48 15.95,37.47 15.95,36.91 15.95,36.35 15.48,34.29 11.11,28.97 12.3,28.02 12.3,29.92 14.45,28.26 16.51,28.42 15.64,30.4 40.64,34.53 42.86,34.53 47.94,30.88 48.1,33.26 52.86,30.88 53.26,30.4 52.63,33.81 53.1,33.26 56.36,34.53 58.58,34.53 58.58,39.53 56.28,39.53 56.28,45.4 42.86,47.62 58.58,45.4 44.61,48.9 41.12,52.31 40,53.34 41.12,54.37 32.7,34.61 34.77,34.61 33.73,33.66 61.91,49.93 63.98,49.93 62.94,50.96 61.59,33.34 63.66,33.34 62.63,32.31 61.36,24.13 60.32,25.08 55.56,21.03 56.59,20 50.4,17.94 52.47,17.94 48.34,17.94 46.04,17.7 44.45,16.91 46.2,24.05 46.2,26.11 45.16,25.08 33.73,29.92 34.77,30.96 32.7,30.96 42.86,27.62 51.36,28.26 68.98,11.03 66.75,8.65 61.91,27.46 48.66,51.91 50.8,49.93 56.67,52.23 59.77,55.32 60.96,56.36 62.23,57.39 62.31,71.04 56.12,65.01 55.72,66.28 55.17,68.02 54.21,71.12 60.01,70.72 58.18,71.28 50.64,76.44 68.26,76.28 43.89,42.7 43.89,41.99 43.89,41.27 45.01,38.89 37.15,41.75 44.05,46.43 2.27,76.2 2.27,3.81 96.79,3.81 96.79,76.2
  pour Top: -3.17,-2.54 102.23,-2.54 102.23,81.28 -3.17,81.28
  pour Bottom: -3.17,-2.54 102.23,-2.54 102.23,81.28 -3.17,81.28
  pour Route2: -1.91,0 99.69,0 99.69,81.28 -1.91,81.28
  pour Route15: -1.91,0 99.69,0 99.69,81.28 -1.91,81.28
N$1
  Top 0.305: R5.2 14,26.98 PWR.A
N$2  (via drill 0.35)
  Top 0.61: FUSE_5V.2 14.52,37.55 v13.34,37.55 USBC.B4A9 | USBC.A4B9 13.32,42.45 v13.34,42.47
  Bottom 0.61: v13.34,42.47 v13.34,37.55
N$3
  Top 0.305: ACT.A R6.2
N$4
  Top 0.305: TX.A R7.2
N$5
  Top 0.305: RX.A R8.2
N$8
  Top 0.305: EXT-VIO.1 60.48,19.45 60.91,19.88 VIO-SELECT.3
N$9
  Top 0.305: CFG-SELECT.2 R10.2
RESET
  Top 0.305: C2.1 R3.2 53.84,23.39 50.11,27.12 U$1.14
RI0  (via drill 0.2)
  Top 0.152: v48.1,45.72 43.74,45.72 41.67,47.78 v31.51,47.78 | v27.3,48.58 24.21,48.58 6.67,66.12 6.67,73.5 UART0.10 | U$1.62 50.11,46.85 v50.09,46.83
  Bottom 0.152: v50.09,46.83 50.24,46.67 50.24,45.88 49.77,45.4 48.42,45.4 v48.1,45.72 | v31.51,47.78 28.1,47.78 v27.3,48.58
RI1  (via drill 0.2)
  Top 0.152: v46.67,33.66 46.51,33.66 45.61,32.75 U$1.5
  Bottom 0.152: v46.67,33.66 29.05,51.28 29.05,73.5 UART1.10
RI2
  Top 0.152: UART2.10 51.75,73.5 52.61,72.64 U$1.57
RI3
  Top 0.152: UART3.10 74.26,71.88 65.88,63.5 65.88,47.15 62.74,44.01 U$1.46
RI4  (via drill 0.2)
  Top 0.152: U$1.88 34.69,40.01 29.21,34.53 v29.21,20.4
  Bottom 0.152: v29.21,20.4 29.21,10.95 24.77,6.51 UART4.10
RI5  (via drill 0.2)
  Top 0.152: v39.93,19.21 39.93,30.32 42.7,33.1 43.89,33.1 44.11,32.88 U$1.2
  Bottom 0.152: v39.93,19.21 39.93,14.05 47.15,6.83 47.15,6.51 UART5.10
RI6
  Top 0.152: UART6.10 69.69,6.51 66.52,9.68 66.52,34.77 58.78,42.51 U$1.43
RI7  (via drill 0.2)
  Top 0.152: v63.02,42.15 92.22,12.95 92.22,6.51 UART7.10 | U$1.40 56.63,41.01 v56.52,41.12
  Bottom 0.152: v56.52,41.12 58.66,43.26 61.91,43.26 v63.02,42.15
RTS0  (via drill 0.2)
  Top 0.152: v46.28,53.9 31.91,68.26 v26.11,68.26 | U$1.71 45.61,52.42 v45.56,52.47
  Bottom 0.152: v46.28,53.9 46.28,53.18 v45.56,52.47 | v26.11,68.26 24.69,69.69 20.8,69.69 16.99,73.5 UART0.5
RTS1  (via drill 0.2)
  Top 0.152: U$1.24 55.11,32.84 v54.61,33.34
  Bottom 0.152: v54.61,33.34 39.85,48.1 33.97,48.1 33.5,48.58 33.5,67.94 39.05,73.5 UART1.5
RTS2
  Top 0.152: UART2.5 61.59,73.5 60.64,74.45 59.29,74.45 58.74,73.9 58.74,72.95 54.61,68.82 U$1.53
RTS3  (via drill 0.2)
  Top 0.152: v68.02,58.34 68.98,58.34 84.14,73.5 UART3.5 | U$1.54 54.11,47.01 54.45,46.67 56.2,46.67 56.83,47.31 56.83,49.05 63.58,55.8 v63.58,56.28
  Bottom 0.152: v68.02,58.34 66.91,58.34 64.85,56.28 v63.58,56.28
RTS4  (via drill 0.2)
  Top 0.152: U$1.91 40.71,38.51 v40.64,38.58
  Bottom 0.152: v40.64,38.58 40.64,37.94 14.76,12.06 14.76,6.51 UART4.5
RTS5  (via drill 0.2)
  Top 0.152: v38.1,33.18 40.93,36.01 U$1.96 | v38.1,16.51 38.1,15.64 37.15,14.68 37.15,6.54 UART5.5
  Bottom 0.152: v38.1,16.51 v38.1,33.18
RTS6  (via drill 0.2)
  Top 0.152: v56.83,30.16 56.83,32.23 55.4,33.66 55.4,35.72 56.69,37.01 U$1.32 | v58.5,30.16 58.5,30 62.71,25.8 62.71,5.56 62.47,5.32 60.09,5.32 59.72,5.68 UART6.5
  Bottom 0.152: v58.5,30.16 v56.83,30.16
RTS7  (via drill 0.2)
  Top 0.152: v61.91,40.16 62.39,40.16 68.58,33.97 68.58,17.46 78.26,7.78 80.96,7.78 82.23,6.51 UART7.5 | U$1.36 60.53,39.01 v60.64,38.89
  Bottom 0.152: v61.91,40.16 v60.64,38.89
RX_S
  Top 0.305: RX.C 39.56,44.69 40.38,45.51 U$1.77
RXD0  (via drill 0.2)
  Top 0.152: v27.78,62.87 36.2,62.87 46.61,52.45 U$1.69
  Bottom 0.152: v27.78,62.87 27.78,67.94 25.24,70.48 22.86,70.48 20.64,72.71 UART0.3
RXD1  (via drill 0.2)
  Top 0.152: v61.2,34.29 60.91,34.01 U$1.26
  Bottom 0.152: v61.2,34.29 61.67,34.29 67.47,40.08 67.47,49.05 43.02,73.5 UART1.3
RXD2
  Top 0.152: UART2.3 65.56,73.5 65.56,47.31 63.02,44.77 58.34,44.77 58.1,45.01 U$1.48
RXD3  (via drill 0.2)
  Top 0.152: v43.1,40.32 43.1,43.74 42.33,44.51 U$1.79 | v65.33,41.12 65.33,42.39 88.11,65.17 88.11,73.5 UART3.3
  Bottom 0.152: v43.1,40.32 43.1,39.77 53.02,29.84 55.24,29.84 59.53,34.13 59.53,35.4 60.56,36.43 61.36,36.43 65.33,40.4 v65.33,41.12
RXD4  (via drill 0.2)
  Top 0.152: v25.32,23.65 25.32,33.5 34.33,42.51 U$1.83
  Bottom 0.152: v25.32,23.65 10.79,9.13 10.79,6.51 UART4.3
RXD5  (via drill 0.2)
  Top 0.152: v43.74,19.61 43.81,19.53 43.81,9.13 42.23,7.54 42.23,5.24 41.59,4.6 33.66,4.6 33.18,5.08 UART5.3 | U$1.16 51.11,30.87 v51.04,30.8
  Bottom 0.152: v51.04,30.8 50.01,30.8 43.74,24.53 v43.74,19.61
RXD6
  Top 0.152: UART6.3 55.72,11.03 54.69,12.06 54.69,23.5 53.42,24.77 53.42,29.45 52.11,30.76 U$1.18
RXD7  (via drill 0.2)
  Top 0.152: v62.86,39.05 67.39,34.53 67.39,17.38 UART7.3 | UART7.3 | U$1.34 61.69,38.01 v61.75,37.94
  Bottom 0.152: v62.86,39.05 v61.75,37.94
TEST
  Top 0.305: R1.1 35.64,36.33 36.31,37.01 U$1.94
TX_S
  Top 0.305: U$1.76 40.39,46.01 39.64,46.75 TX.C
TXD0  (via drill 0.2)
  Top 0.152: v26.27,66.75 26.35,66.67 32.86,66.67 47.11,52.43 U$1.68 | UART0.4 18.64,70.98 v22.78,66.83
  Bottom 0.152: v26.27,66.75 26.19,66.83 v22.78,66.83
TXD1  (via drill 0.2)
  Top 0.152: v55.09,44.13 55.09,33.5 55.61,32.97 U$1.25 | v55.56,50.48 55.56,65.17 62.55,72.15 62.55,74.37 62.15,74.77 51.28,74.77 48.26,71.75 43.02,71.75 41.27,73.5 UART1.4
  Bottom 0.152: v55.56,50.48 55.56,44.61 v55.09,44.13
TXD2  (via drill 0.2)
  Top 0.152: v58.74,47.39 58.74,49.37 64.45,55.09 64.45,72.87 63.82,73.5 UART2.4 | U$1.47 56.62,44.51 v56.52,44.61
  Bottom 0.152: v58.74,47.39 58.74,46.83 v56.52,44.61
TXD3  (via drill 0.2)
  Top 0.152: v44.77,40.32 44.77,43.18 42.94,45.01 U$1.78 | v64.06,42.47 64.06,42.86 86.2,65.01 86.2,73.5 UART3.4
  Bottom 0.152: v44.77,40.32 44.77,39.85 54.13,30.48 54.93,30.48 57.94,33.5 57.94,35.16 58.58,35.8 58.82,35.8 59.61,36.59 59.61,36.83 64.06,41.27 v64.06,42.47
TXD4  (via drill 0.2)
  Top 0.152: v19.13,23.97 19.13,12.94 12.7,6.51 UART4.4 | U$1.80 34.56,44.01 20.95,30.4 v20.95,28.26
  Bottom 0.152: v20.95,28.26 20.24,27.54 20.24,25.08 v19.13,23.97
TXD5  (via drill 0.2)
  Top 0.152: v41.2,15.95 39.69,14.45 39.69,9.29 38.18,7.78 38.18,5.64 37.78,5.24 36.2,5.24 35.18,6.25 UART5.4 | U$1.15 50.61,30.27 50.88,30 v50.88,29.21
  Bottom 0.152: v50.88,29.21 49.37,29.21 47.07,26.91 47.07,21.83 v41.2,15.95
TXD6  (via drill 0.2)
  Top 0.152: v55.56,29.05 57.63,29.05 61.91,24.77 61.91,10.64 57.78,6.51 UART6.4 | v52.47,29.05 52.39,29.05 51.61,29.83 U$1.17
  Bottom 0.152: v55.56,29.05 v52.47,29.05
TXD7
  Top 0.152: UART7.4 80.26,5.97 79.38,5.08 77.71,5.08 77.31,5.48 77.31,6.99 76.28,8.02 73.18,8.02 70.72,5.56 65.41,5.56 64.77,6.19 64.77,34.92 62.19,37.51 U$1.33
UD+  (via drill 0.35)
  Top 0.305: USBC.A6 11.36,40.26 11.11,40.01 11.11,39.53 11.39,39.26 USBC.B6 14.21,39.26 v14.45,39.49 U5.1 | U$1.93 38.93,37.51 v38.73,37.7
  Bottom 0.305: v38.73,37.7 38.66,37.78 19.25,37.78 17.54,39.49 v14.45,39.49
UD-  (via drill 0.35)
  Top 0.305: USBC.A7 12.17,39.77 13.02,39.77 13.18,39.93 13.18,40.48 | 13.18,40.48 13.18,40.52 12.95,40.76 USBC.B7 | 13.18,40.48 15,40.48 15.56,41.04 U5.6 15.56,42.39 16.19,43.02 17.78,43.02 19.61,41.2 19.61,40.01 v20.08,39.53 | U$1.92 40.02,38.01 v39.61,38.42
  Bottom 0.305: v39.61,38.42 38.5,39.53 v20.08,39.53
VIO
  Top 0.305: VIO-SELECT.2 58.98,22.3 58.98,23.76 C13.1 55.24,24.13 54.11,25.27 U$1.22 | U$1.22 U$1.21 | U$1.22 54.11,37.15 | 54.11,37.15 54.11,44.19 55.93,46.01 U$1.50 58.09,46.01 58.33,46.24 60.98,46.24 C12.1 | 54.11,37.15 48.18,37.15 45,33.97 42.63,33.97 42.6,34.01 U$1.100 41.14,34.01 39.76,32.62 33.79,32.62 C7.1
XI
  Top 0.305: U$1.12 49.11,23.96 Y1.1 47.31,22.16 C4.1
XO
  Top 0.305: U$1.13 49.61,23.99 Y1.2 51.44,22.16 51.43,22.16 C3.1

### Text on the board
tNames: RI | DCD | DSR | DTR | CTS | RTS | TXD | RXD | GND | 3V3 | RI | DCD | DSR | DTR | CTS | RTS | TXD | RXD | GND | 3V3 | RI | DCD | DSR | DTR | CTS | RTS | TXD | RXD | GND | 3V3 | RI | DCD | DSR | DTR | CTS | RTS | TXD | RXD | GND | 3V3 | Max Current: / 500mA @ 3.3V | These pins can tolerate / 5V voltage when / used as input: / RXD0 / RXD2 / RXD4 / RXD7 | ! RTFM CH348 ! | CH348L / USB to Octal Serial Ports (UART) / Version 1.0 / S.Schreiter / ripper121.com | TNOW - DTR | + | 1.8V, 2.5V, 3.3V | 3V3 | GND | RXD | TXD | RTS | CTS | DTR | DSR | DCD | RI | 3V3 | GND | RXD | TXD | RTS | CTS | DTR | DSR | DCD | RI | 3V3 | GND | RXD | TXD | RTS | CTS | DTR | DSR | DCD | RI | 3V3 | GND | RXD | TXD | RTS | CTS | DTR | DSR | DCD | RI
bNames: RI | DCD | DSR | DTR | CTS | RTS | TXD | RXD | GND | 3V3 | RI | DCD | DSR | DTR | CTS | RTS | TXD | RXD | GND | 3V3 | RI | DCD | DSR | DTR | CTS | RTS | TXD | RXD | GND | 3V3 | RI | DCD | DSR | DTR | CTS | RTS | TXD | RXD | GND | 3V3 | UART0 | UART1 | UART2 | UART3 | UART4 | UART5 | UART6 | UART7 | 3V3 | GND | RXD | TXD | RTS | CTS | DTR | DSR | DCD | RI | 3V3 | GND | RXD | TXD | RTS | CTS | DTR | DSR | DCD | RI | 3V3 | GND | RXD | TXD | RTS | CTS | DTR | DSR | DCD | RI | 3V3 | GND | RXD | TXD | RTS | CTS | DTR | DSR | DCD | RI